# Altium schematic sheet core.SchDoc
size A4
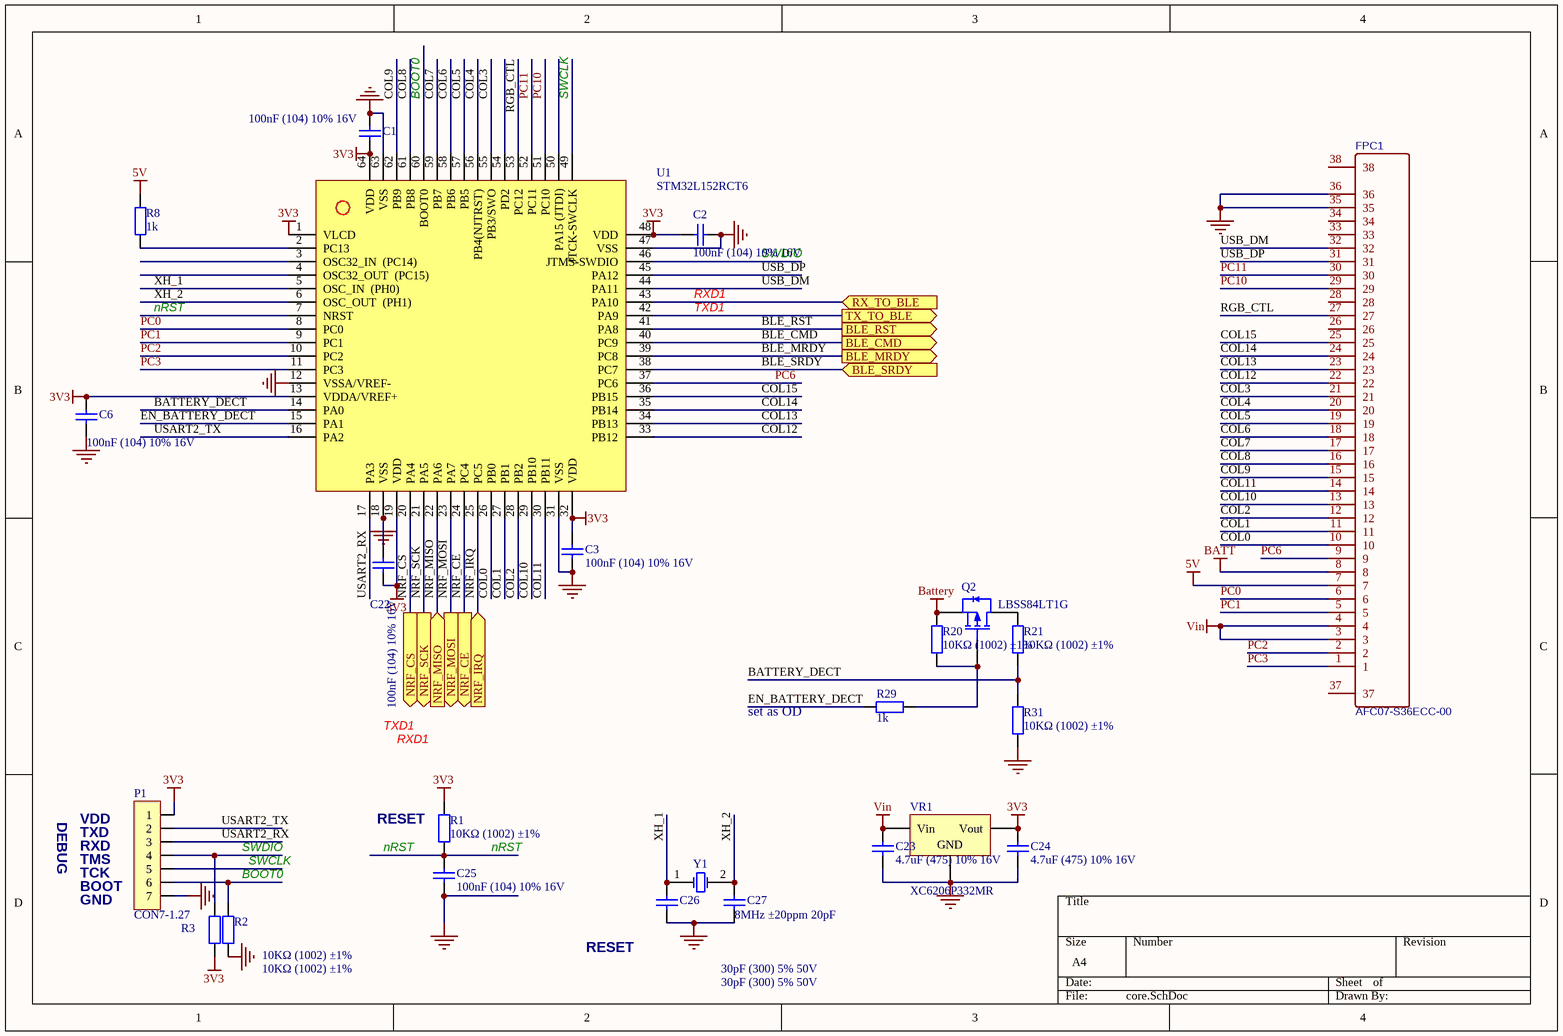
[diagram p0: core.SchDoc]

## Parts
C1  100nF (104) 10% 16V  [0402_C]
C2  100nF (104) 10% 16V  [0402_C]
C3  100nF (104) 10% 16V  [0402_C]
C6  100nF (104) 10% 16V  [0402_C]
C22  100nF (104) 10% 16V  [0402_C]
C23  4.7uF (475) 10% 16V  [0603_C]
C24  4.7uF (475) 10% 16V  [0603_C]
C25  100nF (104) 10% 16V  [0402_C]
C26  30pF (300) 5% 50V  [0402_C]
C27  30pF (300) 5% 50V  [0402_C]
FPC1  AFC07-S36ECC-00  [FPC-0.5MM-36P-LCS-SJ-H2.0]
P1  CON7-1.27  [PH_7PIN_1.25_H-2]
Q2  LBSS84LT1G  [sot-23]
R1  10KΩ (1002) ±1%  [0402_R]
R2  10KΩ (1002) ±1%  [0402_R]
R3  10KΩ (1002) ±1%  [0402_R]
R8  1k  [0402_R]
R20  10KΩ (1002) ±1%  [0402_R]
R21  10KΩ (1002) ±1%  [0402_R]
R29  1k  [0402_R]
R31  10KΩ (1002) ±1%  [0402_R]
U1  STM32L152RCT6  [LQFP64]
VR1  XC6206P332MR  [SOT-23-3L]
Y1  8MHz ±20ppm 20pF  [SMD-5032_2P]

## Ports
BLE_CMD (out), BLE_MRDY (out), BLE_RST (out), BLE_SRDY (in), NRF_CE (out), NRF_CS (out), NRF_IRQ (in), NRF_MISO (in), NRF_MOSI (out), NRF_SCK (out), RX_TO_BLE (in), TX_TO_BLE (out)

## Nets
3V3: C1.1 C2.2 C3.2 C6.2 C22.1 C24.2 P1.1 R1.2 R3.1 U1.1(VLCD) U1.13(VDDA/VREF+) U1.19(VDD) U1.32(VDD) U1.48(VDD) U1.64(VDD) VR1.2(Vout)
5V: FPC1.7 R8.1
BATT: FPC1.8
Battery: Q2.2(S) R20.2
GND: C1.2 C2.1 C3.1 C6.1 C22.2 C23.1 C24.1 C25.1 C26.1 C27.1 FPC1.35 FPC1.36 P1.7 R2.1 R31.1 U1.12(VSSA/VREF-) U1.18(VSS) U1.31(VSS) U1.47(VSS) U1.63(VSS) VR1.1(GND)
Vin: C23.2 FPC1.3 FPC1.4 VR1.3(Vin)
BATTERY_DECT: R21.1 R31.2 U1.14(PA0)
BLE_CMD: U1.40(PC9) ; port BLE_CMD
BLE_MRDY: U1.39(PC8) ; port BLE_MRDY
BLE_RST: U1.41(PA8) ; port BLE_RST
BLE_SRDY: U1.38(PC7) ; port BLE_SRDY
BOOT0: P1.6 R2.2 U1.60(BOOT0)
COL0: FPC1.10 U1.26(PB0)
COL1: FPC1.11 U1.27(PB1)
COL2: FPC1.12 U1.28(PB2)
COL3: FPC1.21 U1.55(PB3/SWO)
COL4: FPC1.20 U1.56(PB4(NJTRST))
COL5: FPC1.19 U1.57(PB5)
COL6: FPC1.18 U1.58(PB6)
COL7: FPC1.17 U1.59(PB7)
COL8: FPC1.16 U1.61(PB8)
COL9: FPC1.15 U1.62(PB9)
COL10: FPC1.13 U1.29(PB10)
COL11: FPC1.14 U1.30(PB11)
COL12: FPC1.22 U1.33(PB12)
COL13: FPC1.23 U1.34(PB13)
COL14: FPC1.24 U1.35(PB14)
COL15: FPC1.25 U1.36(PB15)
EN_BATTERY_DECT: R29.2 U1.15(PA1)
NRF_CE: U1.24(PC4) ; port NRF_CE
NRF_CS: U1.20(PA4) ; port NRF_CS
NRF_IRQ: U1.25(PC5) ; port NRF_IRQ
NRF_MISO: U1.22(PA6) ; port NRF_MISO
NRF_MOSI: U1.23(PA7) ; port NRF_MOSI
NRF_SCK: U1.21(PA5) ; port NRF_SCK
nRST: C25.2 R1.1 U1.7(NRST)
PC0: FPC1.6 U1.8(PC0)
PC1: FPC1.5 U1.9(PC1)
PC2: FPC1.2 U1.10(PC2)
PC3: FPC1.1 U1.11(PC3)
PC6: FPC1.9 U1.37(PC6)
PC10: FPC1.29 U1.51(PC10)
PC11: FPC1.30 U1.52(PC11)
RGB_CTL: FPC1.27 U1.53(PC12)
RXD1: U1.43(PA10) ; port RX_TO_BLE
SWCLK: P1.5 U1.49(JTCK-SWCLK)
SWDIO: P1.4 R3.2 U1.46(JTMS-SWDIO)
TXD1: U1.42(PA9) ; port TX_TO_BLE
USART2_RX: P1.3 U1.17(PA3)
USART2_TX: P1.2 U1.16(PA2)
USB_DM: FPC1.32 U1.44(PA11)
USB_DP: FPC1.31 U1.45(PA12)
XH_1: C26.2 U1.5(OSC_IN__(PH0)) Y1.1(OSC1)
XH_2: C27.2 U1.6(OSC_OUT__(PH1)) Y1.2(OSC2)
NetQ2_1: Q2.1(G) R20.1 R29.1
NetQ2_3: Q2.3(D) R21.2
NetR8_2: R8.2 U1.2(PC13)

Not connected (* = marked no-connect by the designer): FPC1 26 28 33 34 37 38; U1 3(OSC32_IN__(PC14)) 4(OSC32_OUT__(PC15)) 50(PA15_(JTDI)) 54(PD2)

## Notes on the sheet
- set as OD
- DEBUG
- VDD
- TXD
- RXD
- (near R1) RESET
- TMS
- TCK
- GND
- (near P1) BOOT
- RESET
- Labels drawn without touching a wire or pin: RXD1, TXD1

## Library data of the parts
C1-C3 C6 C22 C25 = 0402 100nF (104) 10% 16V: 贴片电容; ComponentLink1Description: 供应商链接; ComponentLink1URL: http://www.szlcsc.com/product/details_1877.html; Package: 0402; Supplier: LC; SuppliersPartNumber: C1525
C23 C24 = 0603 4.7uF (475) 10% 16V: 贴片电容; ComponentLink1Description: 供应商链接; ComponentLink1URL: http://www.szlcsc.com/product/details_20375.html; Package: 0603; Supplier: LC; SuppliersPartNumber: C19666
C26 C27 = 0402 30pF (300) 5% 50V: 贴片电容; ComponentLink1Description: 供应商链接; ComponentLink1URL: http://www.szlcsc.com/product/details_1922.html; Package: 0402; Supplier: LC; SuppliersPartNumber: C1570
FPC1 = AFC07-S36ECC-00: BOM_Manufacturer: JUSHUO; Contributor: LCSC; BOM_Supplier: LCSC; BOM_Supplier Part: C262254; BOM_Manufacturer Part: AFC07-S36ECC-00; spicePre: F
P1 = CON7: 直插插座; Part Number: RP02.07.000049; LatestRevisionDate: 09-Feb-2017; LatestRevisionNote: SCHlib build; Publisher: ChenYinaho; Manufacturer: *; Manufacturer Part Number: *; Value: CON7-1.27
Q2 = P-MOS_BSS84: P-MOSFET -50V,-0.13A,10Ω@-5V; Manufacturer: LRC(乐山无线电); Part Number: NEW; LatestRevisionDate: 09-Feb-2017; LatestRevisionNote: SCHlib build; Publisher: ChenYinaho; PackageDescription: SOT-23(SOT-23-3); Manufacturer Part Number: LBSS84LT1G; Value: LBSS84LT1G
R1-R3 R20 R21 R31 = 0402 10KΩ (1002) 1%: 贴片电阻; ComponentLink1Description: 供应商链接; ComponentLink1URL: http://www.szlcsc.com/product/details_26487.html; Package: 0402; Supplier: LC; SuppliersPartNumber: C25744
R8 R29 = Res-0402_1k: 表贴电阻,0402,±1%,1/16W; Part Number: RP02.03.000161; LatestRevisionDate: 09-Feb-2017; LatestRevisionNote: SCHlib build; Publisher: ChenYinaho; PackageDescription: 0402R; Manufacturer: *; Manufacturer Part Number: *; Value: 1k
U1 = STM32L152RCT: MCU IC; Manufacturer: ST; Part Number: NEW; LatestRevisionDate: 09-Feb-2017; LatestRevisionNote: SCHlib build; Publisher: ChenYinaho; Manufacturer Part Number: STM32L152RCT6; Value: STM32L152RCT6
VR1 = SOT-23 XC6206P332MR: 低压差线性稳压(LDO); ComponentLink1Description: 供应商链接; ComponentLink1URL: http://www.szlcsc.com/product/details_5896.html; Package: SOT-23; Supplier: LC; SuppliersPartNumber: C5446
Y1 = SMD-5032_2P 8MHz 20ppm 20pF: 贴片晶振; ComponentLink1Description: 供应商链接; ComponentLink1URL: http://www.szlcsc.com/product/details_117214.html; Package: SMD-5032_2P; Supplier: LC; SuppliersPartNumber: C115962